# EAGLE design Accelerator (EAGLE 9.6.2)
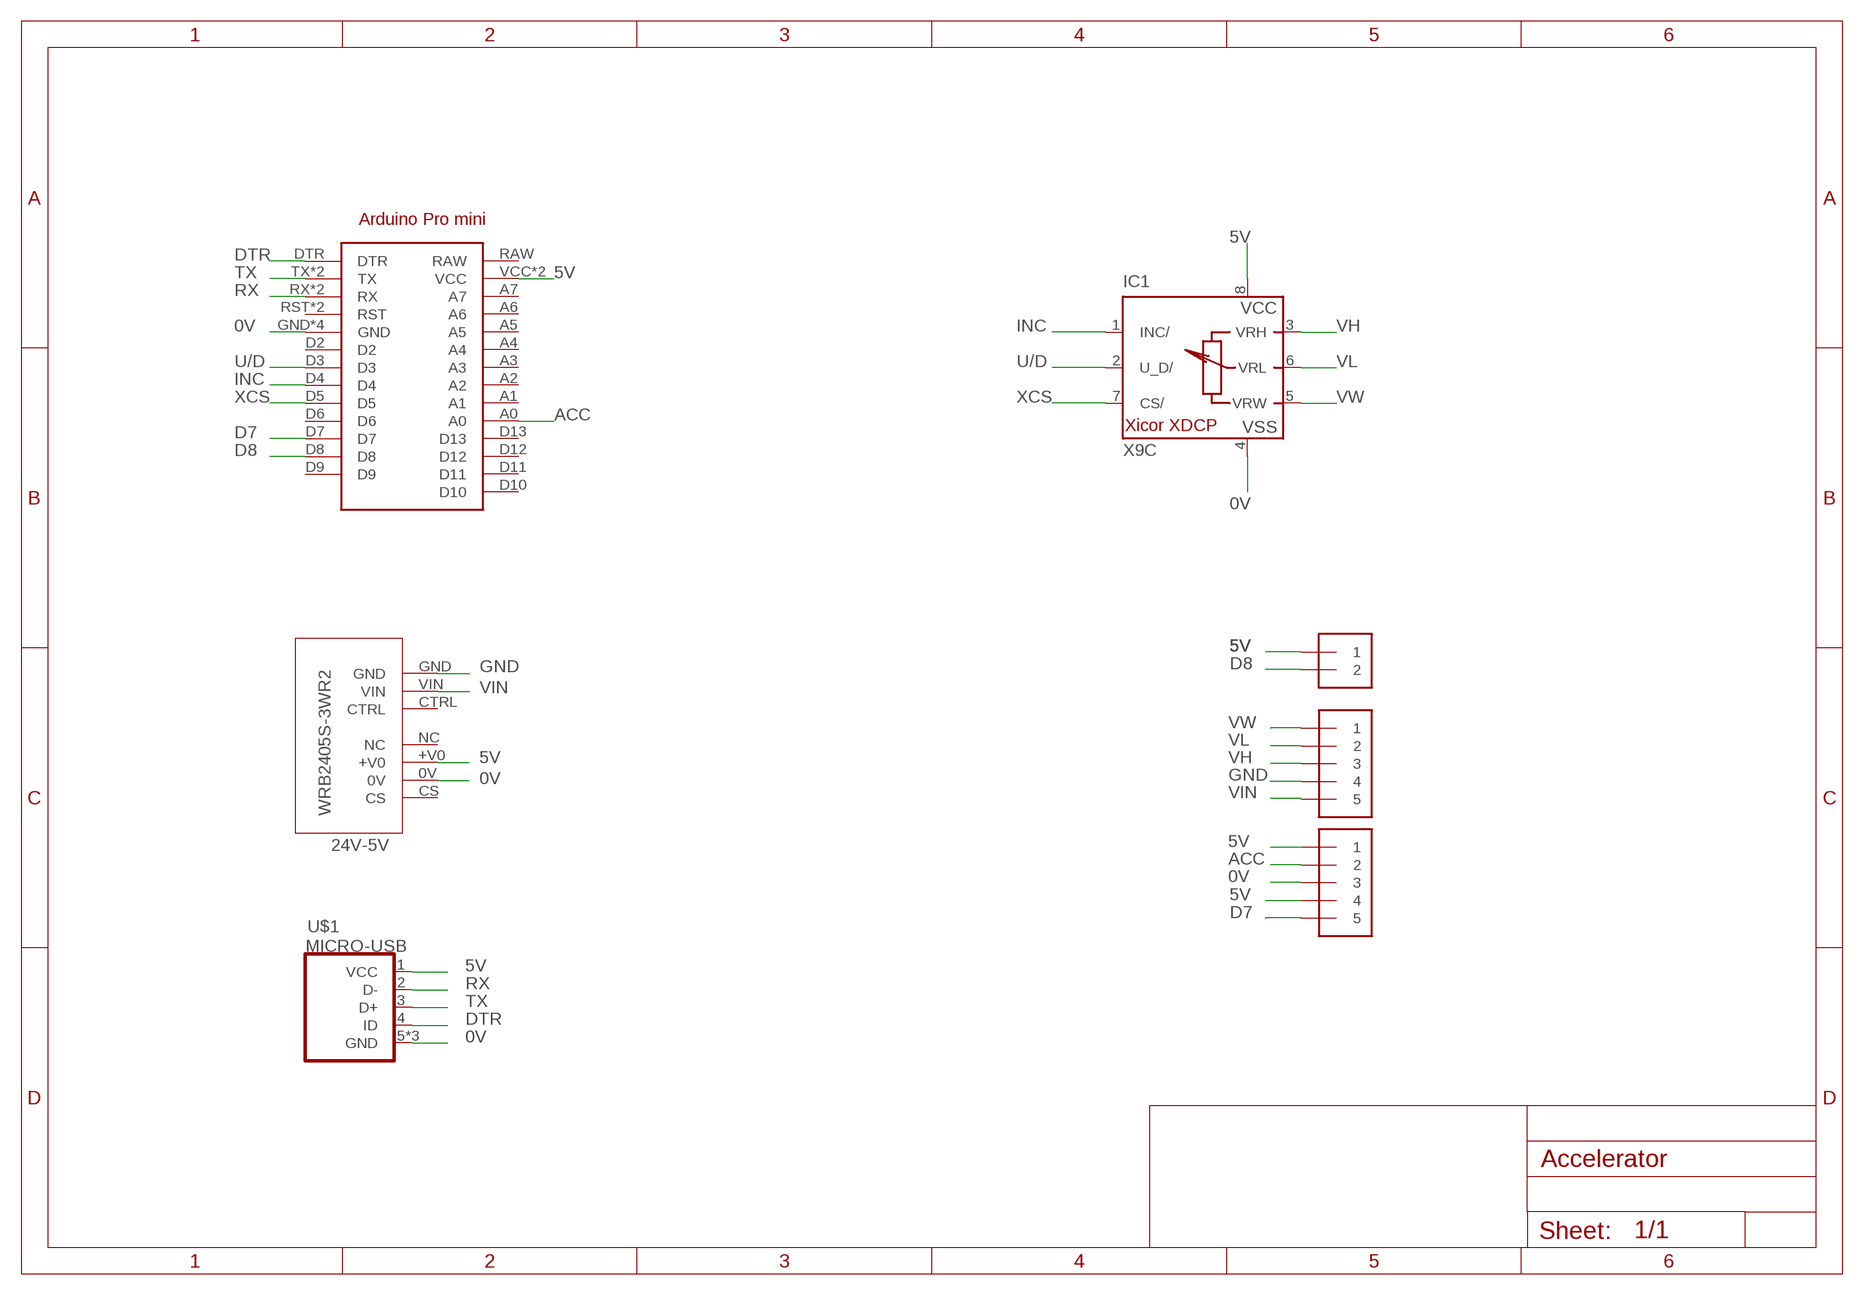
[diagram p0: schematic, sheet 1]

## Parts
ARDUINO1  ARDUINO_PRO_MINI  [ARDUINO_PRO_MINI]
IC1  X9C  [DIL08]
J1  1X5  [1X05-3.5MM]
J2  1X5  [1X05-3.5MM]
J3  1X2-3.5MM  [1X2-3.5MM]
U2  WRB2405S-3WR2  [WRB2405S-3WR2]
U$1  MICRO-USB  [MICRO-USB]

## Nets
0V: ARDUINO1.GND ARDUINO1.GND@1(GND) ARDUINO1.GND@2(GND) ARDUINO1.GND@3(GND) IC1.4(VSS) J2.3 U2.0V U$1.5(GND) U$1.GND1(GND) U$1.GND2(GND)
5V: ARDUINO1.VCC ARDUINO1.VCC@1(VCC) IC1.8(VCC) J2.1 J2.4 J3.1 U2.+V0 U$1.1(VCC)
ACC: ARDUINO1.A0 J2.2
D7: ARDUINO1.D7 J2.5
D8: ARDUINO1.D8 J3.2
DTR: ARDUINO1.DTR U$1.4(ID)
GND: J1.4 U2.GND
INC: ARDUINO1.D4 IC1.1(INC/)
RX: ARDUINO1.RX ARDUINO1.RX@1(RX) U$1.2(D-)
TX: ARDUINO1.TX ARDUINO1.TX@1(TX) U$1.3(D+)
U/D: ARDUINO1.D3 IC1.2(U_D/)
VH: IC1.3(VRH) J1.3
VIN: J1.5 U2.VIN
VL: IC1.6(VRL) J1.2
VW: IC1.5(VRW) J1.1
XCS: ARDUINO1.D5 IC1.7(CS/)
Unconnected: ARDUINO1.A1 ARDUINO1.A2 ARDUINO1.A3 ARDUINO1.A4 ARDUINO1.A5 ARDUINO1.A6 ARDUINO1.A7 ARDUINO1.D2 ARDUINO1.D6 ARDUINO1.D9 ARDUINO1.D10 ARDUINO1.D11 ARDUINO1.D12 ARDUINO1.D13 ARDUINO1.RAW ARDUINO1.RST ARDUINO1.RST@1(RST) U2.CS U2.CTRL U2.NC

## Library data of the parts
ARDUINO1 = arduinopromini:ARDUINO_PRO_MINI: For creating Arduino Pro Mini shields
IC1 = xicor-eepot:X9C*: Xicor Digitally controlled Potentiometer (EEPOT) by Xicor (now at www.intersil.com)
J1 J2 = adafruit:1X5
J3 = adafruit:1X2: 3.5mm Terminal block http://www.ladyada.net/library/pcb/eaglelibrary.html
U2 = DC_DC converter:WRB2405S-3WR2
U$1 = microusb:MICRO-USB: Micro USB B connector

## Board
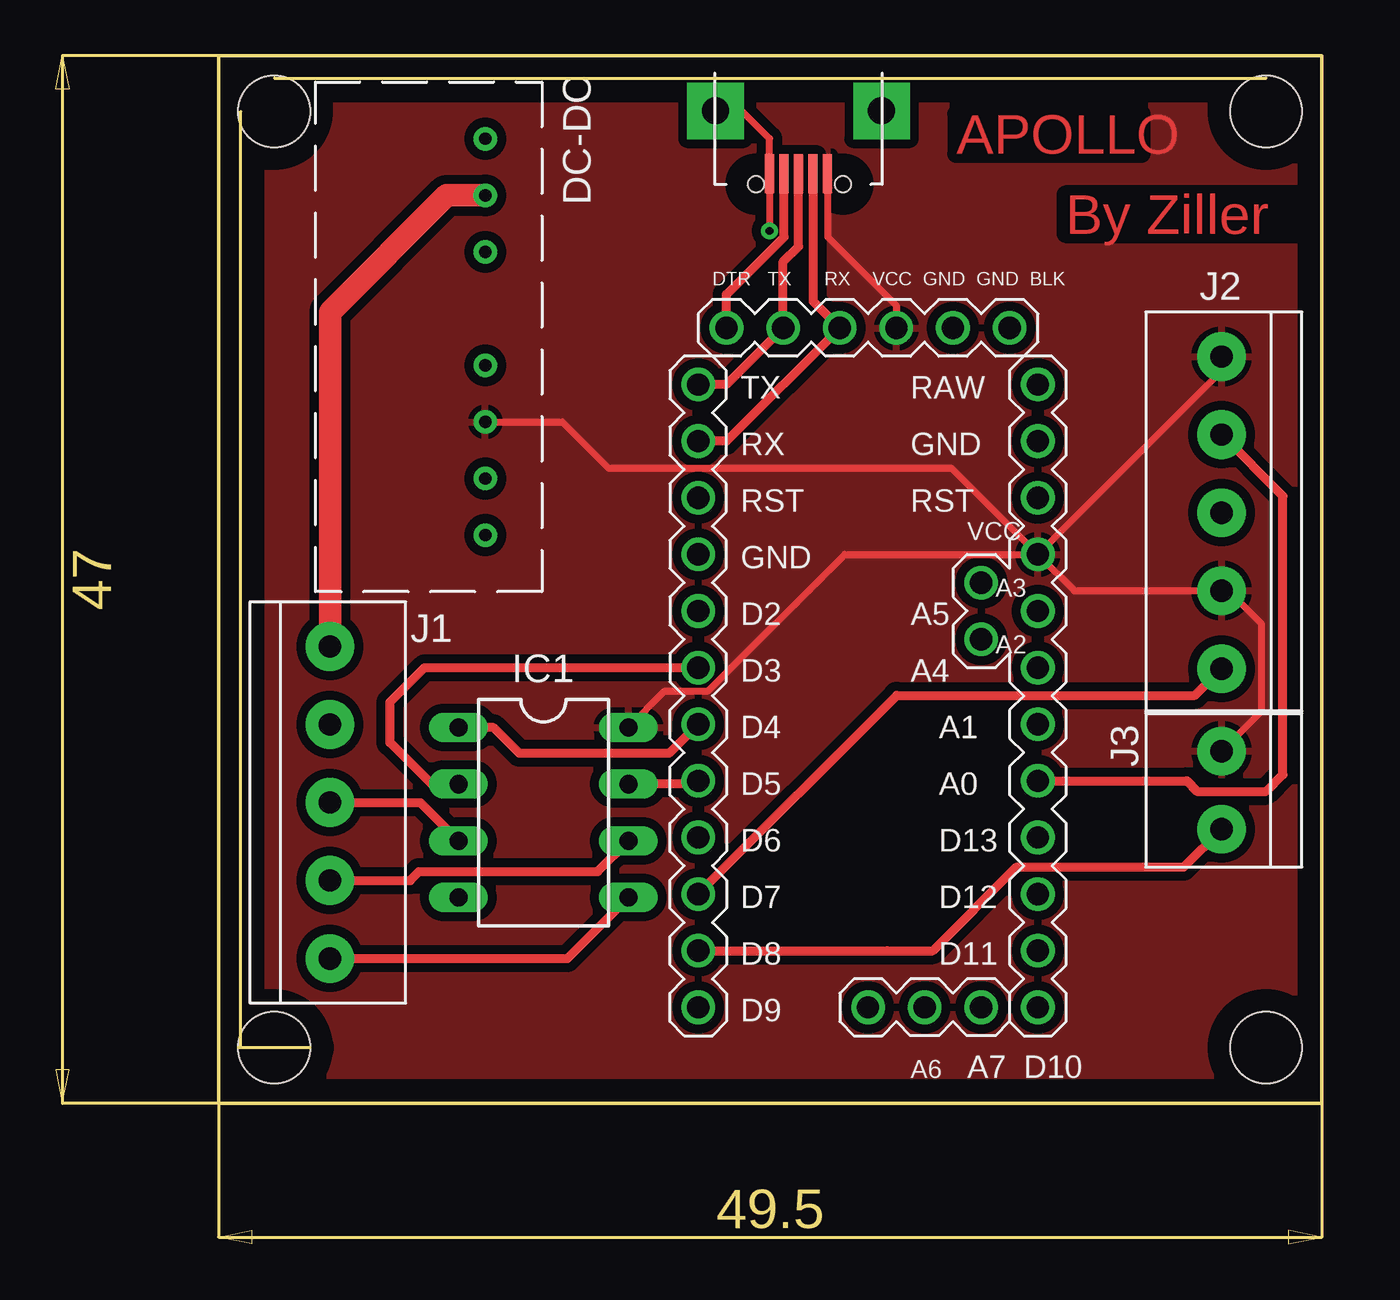
[diagram p1: board, top side]
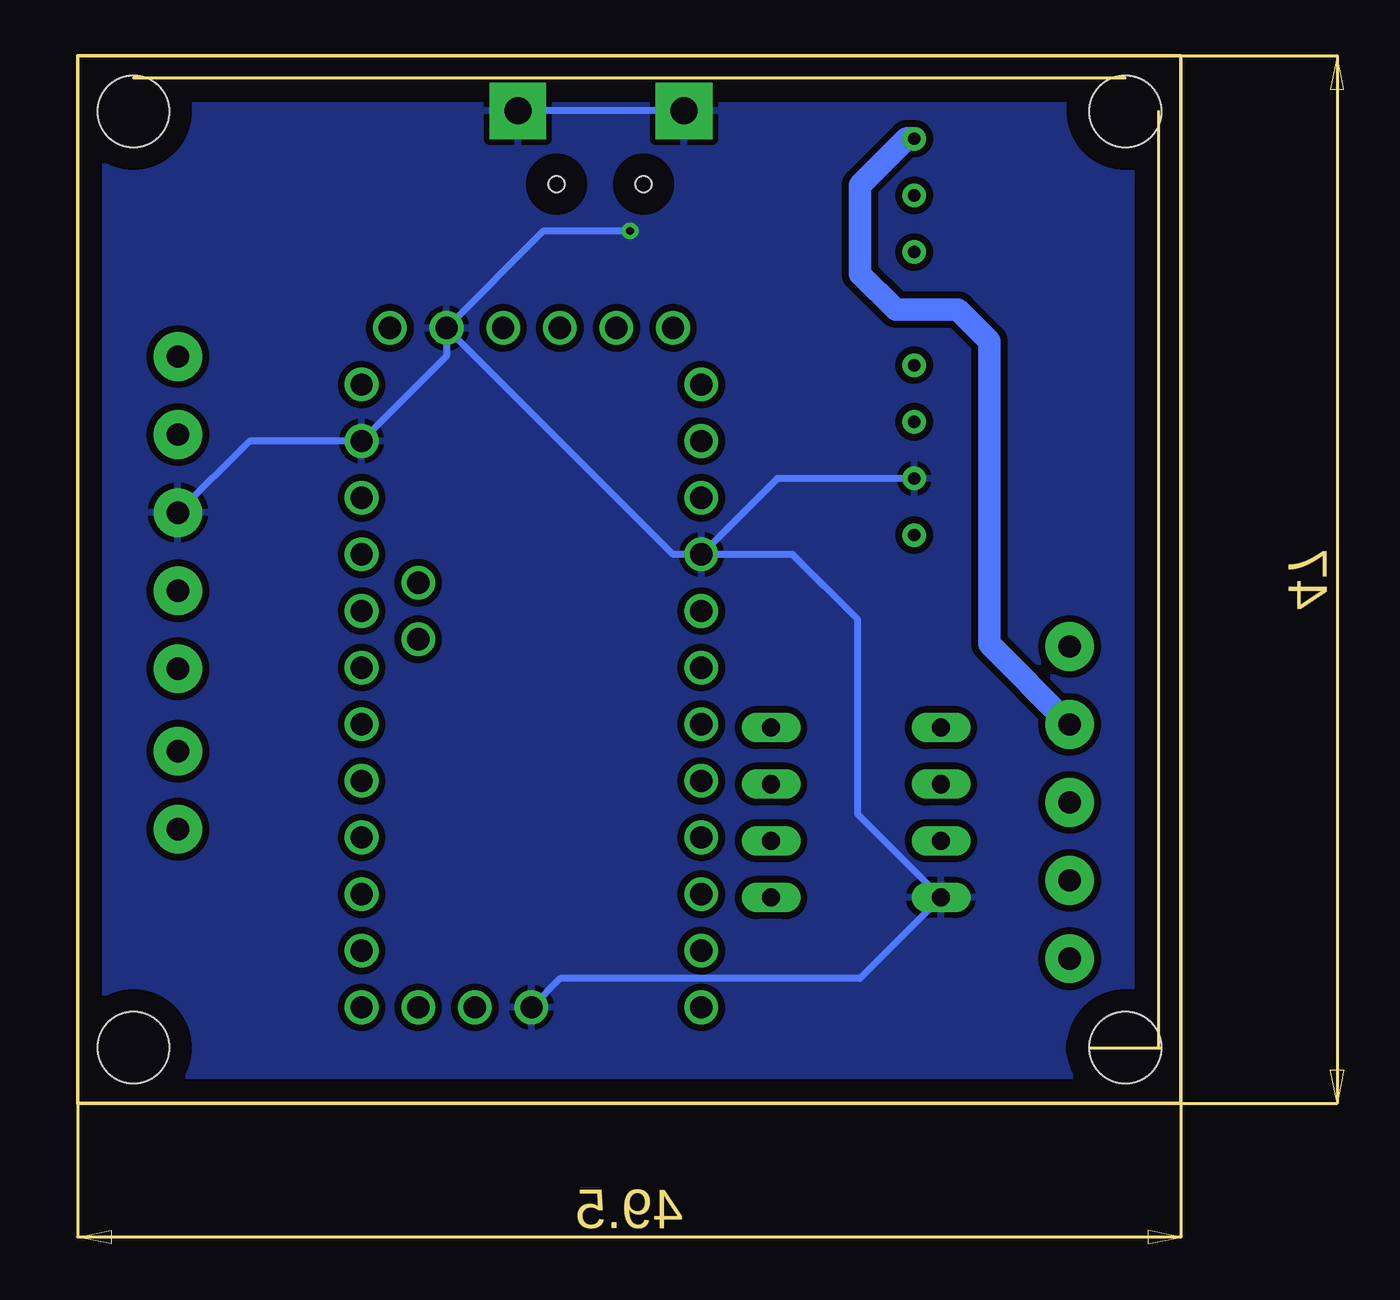
[diagram p2: board, bottom side, seen from below]

Size 49.5 x 47 mm. Coordinates in mm from the lower left corner, seen from the top.
Outline: 0,0 49.5,0 49.5,47 0,47 0,0
Copper layers (1*16): Top 0.035mm / dielectric 1.5mm / Bottom 0.035mm
Design rules "default": minimum track width 6mil, minimum drill 0.35mm, track to track 6mil, track to pad 6mil, pad to pad 6mil, via to via 6mil, smd to smd 6mil, copper to edge 40mil, drill to drill 6mil, minimum pad ring 10mil, minimum via ring 8mil, stop-mask expansion 4mil, vias tented up to drill 0mil, thermal gap 10mil
Holes 3.2 mm at 2.5,2.5 2.5,44.5 47,44.5 47,2.5

### Footprints (pad centres in the part's own frame; a part is rotated, then mirrored left to right if it is on the bottom)
ARDUINO_PRO_MINI = drill 1: A0 11.43,-8.89; A1 11.43,-6.35; A2 11.43,-3.81; A3 11.43,-1.27; A4 8.89,-2.54; A5 8.89,0; A6 6.35,-19.05; A7 8.89,-19.05; BLK 10.16,11.43; D2 -3.81,-1.27; D3 -3.81,-3.81; D4 -3.81,-6.35; D5 -3.81,-8.89; D6 -3.81,-11.43; D7 -3.81,-13.97; D8 -3.81,-16.51; D9 -3.81,-19.05; D10 11.43,-19.05; D11 11.43,-16.51; D12 11.43,-13.97; D13 11.43,-11.43; DTR -2.54,11.43; GND -3.81,1.27; GND@1 11.43,6.35; GND@2 7.62,11.43; GND@3 3.81,-19.05; RAW 11.43,8.89; RST 11.43,3.81; RST@1 -3.81,3.81; RX -3.81,6.35; RX@1 2.54,11.43; TX -3.81,8.89; TX@1 0,11.43; VCC 11.43,1.27; VCC@1 5.08,11.43
DIL08 = drill 0.813 long: 1 -3.81,-3.81; 2 -1.27,-3.81; 3 1.27,-3.81; 4 3.81,-3.81; 5 3.81,3.81; 6 1.27,3.81; 7 -1.27,3.81; 8 -3.81,3.81
1X05-3.5MM = drill 1 pad 2.184: 1 7,0; 2 3.5,0; 3 0,0; 4 -3.5,0; 5 -7,0
1X2-3.5MM = drill 1 pad 2.184: 1 1.8,0; 2 -1.7,0
WRB2405S-3WR2 = drill 0.55: 0V 7.62,2.54; +V0 5.08,2.54; CS 10.16,2.54; CTRL -2.54,2.54; GND -7.62,2.54; NC 2.54,2.54; VIN -5.08,2.54
MICRO-USB = smd 0.4 x 1.75: 1 -1.3,4.525; 2 -0.65,4.525; 3 0,4.525; 4 0.65,4.525; 5 1.3,4.525 | drill 1.2 pad 2.54 square: GND1 -3.725,1.7; GND2 3.725,1.7 | hole 0.7: -2,5; 1.9,5

### Placement (x,y rotation side)
ARDUINO1  25.33,23.36 0 top
IC1  14.58,13.05 270 top
J1  5,13.5 270 top
J2  45,26.5 90 top
J3  45,14 90 top
U2  9.43,35.66 270 top
U$1  26.02,46.23 180 top

### Tracks (layer width: path | path; a pad name or v marks a point on that pad's centre or on a via)
0V  (via drill 0.35)
  Top 0.305: v24.71,39.14 v24.72,39.15 U$1.5 24.72,43.28 23.47,44.53 U$1.GND2
  Bottom 0.305: ARDUINO1.GND 22.79,24.63 ARDUINO1.GND@2 | ARDUINO1.GND@2 32.95,33.52 ARDUINO1.GND@1 41.79,29.71 J2.3 | ARDUINO1.GND@2 28.6,39.14 v24.71,39.14 | ARDUINO1.GND 18.11,28.04 U2.0V | U$1.GND2 U$1.GND1 | ARDUINO1.GND@3 27.85,5.6 14.41,5.6 IC1.4 14.5,12.97 14.5,21.7 17.43,24.63 ARDUINO1.GND
  pour Bottom (isolate 0.305): 0.4,46.7 0.4,0.7 49,0.7 49,46.7
5V
  Top 0.305: U$1.1 27.32,38.88 30.41,35.79 ARDUINO1.VCC@1 | U2.+V0 15.43,30.57 17.5,28.5 32.89,28.5 ARDUINO1.VCC | IC1.8 20.02,18.49 21.96,18.49 28.1,24.63 ARDUINO1.VCC | ARDUINO1.VCC 38.39,23 J2.4 45.3,23 46.8,21.5 46.8,17.6 J3.1 | ARDUINO1.VCC 45,32.87 J2.1
  pour Top (isolate 0.406): 0.4,45.9 0.4,0.7 49,0.7 49,46.6 0.4,46.6
ACC
  Top 0.406: ARDUINO1.A0 43.43,14.47 43.9,14 47,14 47.76,14.76 47.76,27.24 J2.2
D7
  Top 0.406: ARDUINO1.D7 30.43,18.3 43.8,18.3 J2.5
D8
  Top 0.406: ARDUINO1.D8 30,6.85 32.05,6.85 35.8,10.6 43.3,10.6 J3.2
DTR
  Top 0.406: ARDUINO1.DTR 22.79,36.29 25.37,38.87 U$1.4
GND
  Bottom 1.016: U2.GND 11.95,43.3 12.3,43.3 14.4,41.2 14.4,37.2 12.8,35.6 10,35.6 8.6,34.2 8.6,20.6 J1.4
INC
  Top 0.406: ARDUINO1.D4 20.21,15.7 13.5,15.7 12.34,16.86 IC1.1
RX
  Top 0.406: U$1.2 26.67,35.99 ARDUINO1.RX@1 22.79,29.71 ARDUINO1.RX
TX
  Top 0.406: U$1.3 26.02,38.45 25.33,37.76 ARDUINO1.TX@1 22.79,32.25 ARDUINO1.TX
U/D
  Top 0.406: IC1.2 9.57,14.32 7.7,16.19 7.7,18 9.25,19.55 ARDUINO1.D3
VH
  Top 0.406: J1.3 9.05,13.5 IC1.3
VIN
  Top 1.016: J1.5 5,35.5 10.23,40.73 U2.VIN
VL
  Top 0.406: J1.2 8.6,10 9,10.4 17.01,10.4 IC1.6
VW
  Top 0.406: J1.1 15.65,6.5 IC1.5
XCS
  Top 0.305: ARDUINO1.D5 21.37,14.32
  Top 0.406: 21.37,14.32 IC1.7

### Text on the board
Top: APOLLO | By Ziller